# EAGLE schematic VibeMotors (EAGLE 9.0.1)
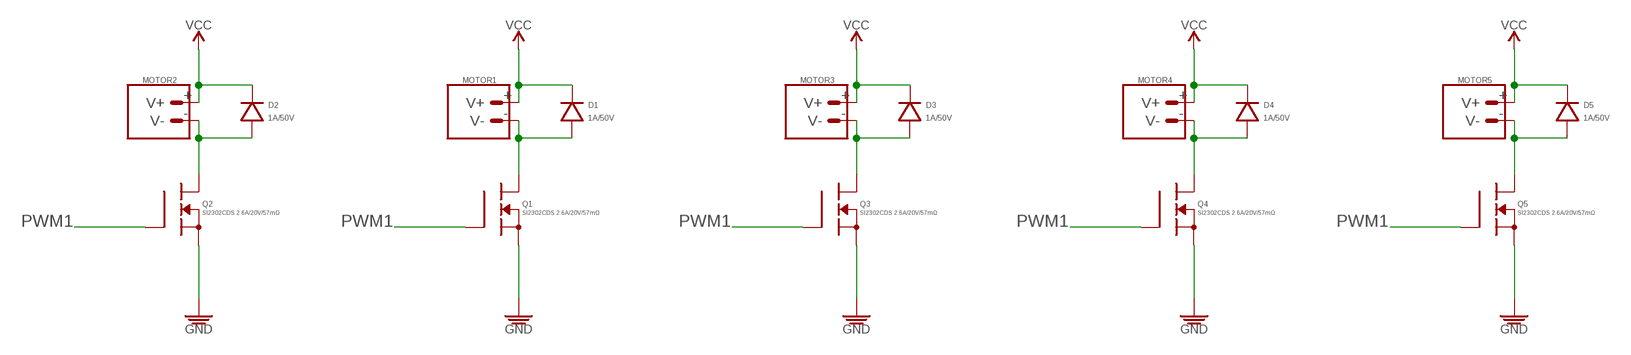
[diagram p0: schematic, sheet 1]

## Parts
D1  1A/50V  DIODE_GENERAL-PURPOSE_SMD_GP_1A-50V  [SOD123F]
D2  1A/50V  DIODE_GENERAL-PURPOSE_SMD_GP_1A-50V  [SOD123F]
D3  1A/50V  DIODE_GENERAL-PURPOSE_SMD_GP_1A-50V  [SOD123F]
D4  1A/50V  DIODE_GENERAL-PURPOSE_SMD_GP_1A-50V  [SOD123F]
D5  1A/50V  DIODE_GENERAL-PURPOSE_SMD_GP_1A-50V  [SOD123F]
MOTOR1  MOTOR_PADSPTH  [CONNECTOR_MOTOR]
MOTOR2  MOTOR_PADSPTH  [CONNECTOR_MOTOR]
MOTOR3  MOTOR_PADSPTH  [CONNECTOR_MOTOR]
MOTOR4  MOTOR_PADSPTH  [CONNECTOR_MOTOR]
MOTOR5  MOTOR_PADSPTH  [CONNECTOR_MOTOR]
Q1  SI2302CDS 2.6A/20V/57mΩ  MOSFET_N-CHANNEL_SI2302CDS_2.6A-20V-0.057OHM  [SOT23-3]
Q2  SI2302CDS 2.6A/20V/57mΩ  MOSFET_N-CHANNEL_SI2302CDS_2.6A-20V-0.057OHM  [SOT23-3]
Q3  SI2302CDS 2.6A/20V/57mΩ  MOSFET_N-CHANNEL_SI2302CDS_2.6A-20V-0.057OHM  [SOT23-3]
Q4  SI2302CDS 2.6A/20V/57mΩ  MOSFET_N-CHANNEL_SI2302CDS_2.6A-20V-0.057OHM  [SOT23-3]
Q5  SI2302CDS 2.6A/20V/57mΩ  MOSFET_N-CHANNEL_SI2302CDS_2.6A-20V-0.057OHM  [SOT23-3]

## Nets
GND: Q1.S Q2.S Q3.S Q4.S Q5.S
N$1: D1.A MOTOR1.-(V-) Q1.D
N$2: D2.A MOTOR2.-(V-) Q2.D
N$3: D3.A MOTOR3.-(V-) Q3.D
N$4: D4.A MOTOR4.-(V-) Q4.D
N$5: D5.A MOTOR5.-(V-) Q5.D
PWM1: Q1.G Q2.G Q3.G Q4.G Q5.G
VCC: D1.K D2.K D3.K D4.K D5.K MOTOR1.+(V+) MOTOR2.+(V+) MOTOR3.+(V+) MOTOR4.+(V+) MOTOR5.+(V+)

## Library data of the parts
D1-D5 = PiB_discrete_semiconductors:DIODE_GENERAL-PURPOSE; CREATOR: MrSwirlyEyes; DATASHEET: http://www.comchiptech.com/cms/UserFiles/CGRKM4001-HF%20Thru.%20CGRKM4007-HF%20RevG.pdf; DIST: Digikey; DISTLINK: https://www.digikey.com/products/en?keywords=641-1511-1-ND; DISTPN: 641-1511-1-ND; MFR: Comchip Technology; MPN: CGRKM4001-HF; TESTED: NO
MOTOR1-MOTOR5 = PiB:MOTOR_PADS
Q1-Q5 = PiB_discrete_semiconductors:MOSFET_N-CHANNEL; CREATOR: MrSwirlyEyes; DATASHEET: http://www.vishay.com/docs/68645/si2302cds.pdf; DIST: Digikey; DISTLINK: https://www.digikey.com/product-detail/en/vishay-siliconix/SI2302CDS-T1-GE3/SI2302CDS-T1-GE3CT-ND/1978877; DISTPN: SI2302CDS-T1-GE3CT-ND; MFR: Vishay Siliconix; MPN: SI2302CDS-T1-GE3; TESTED: NO